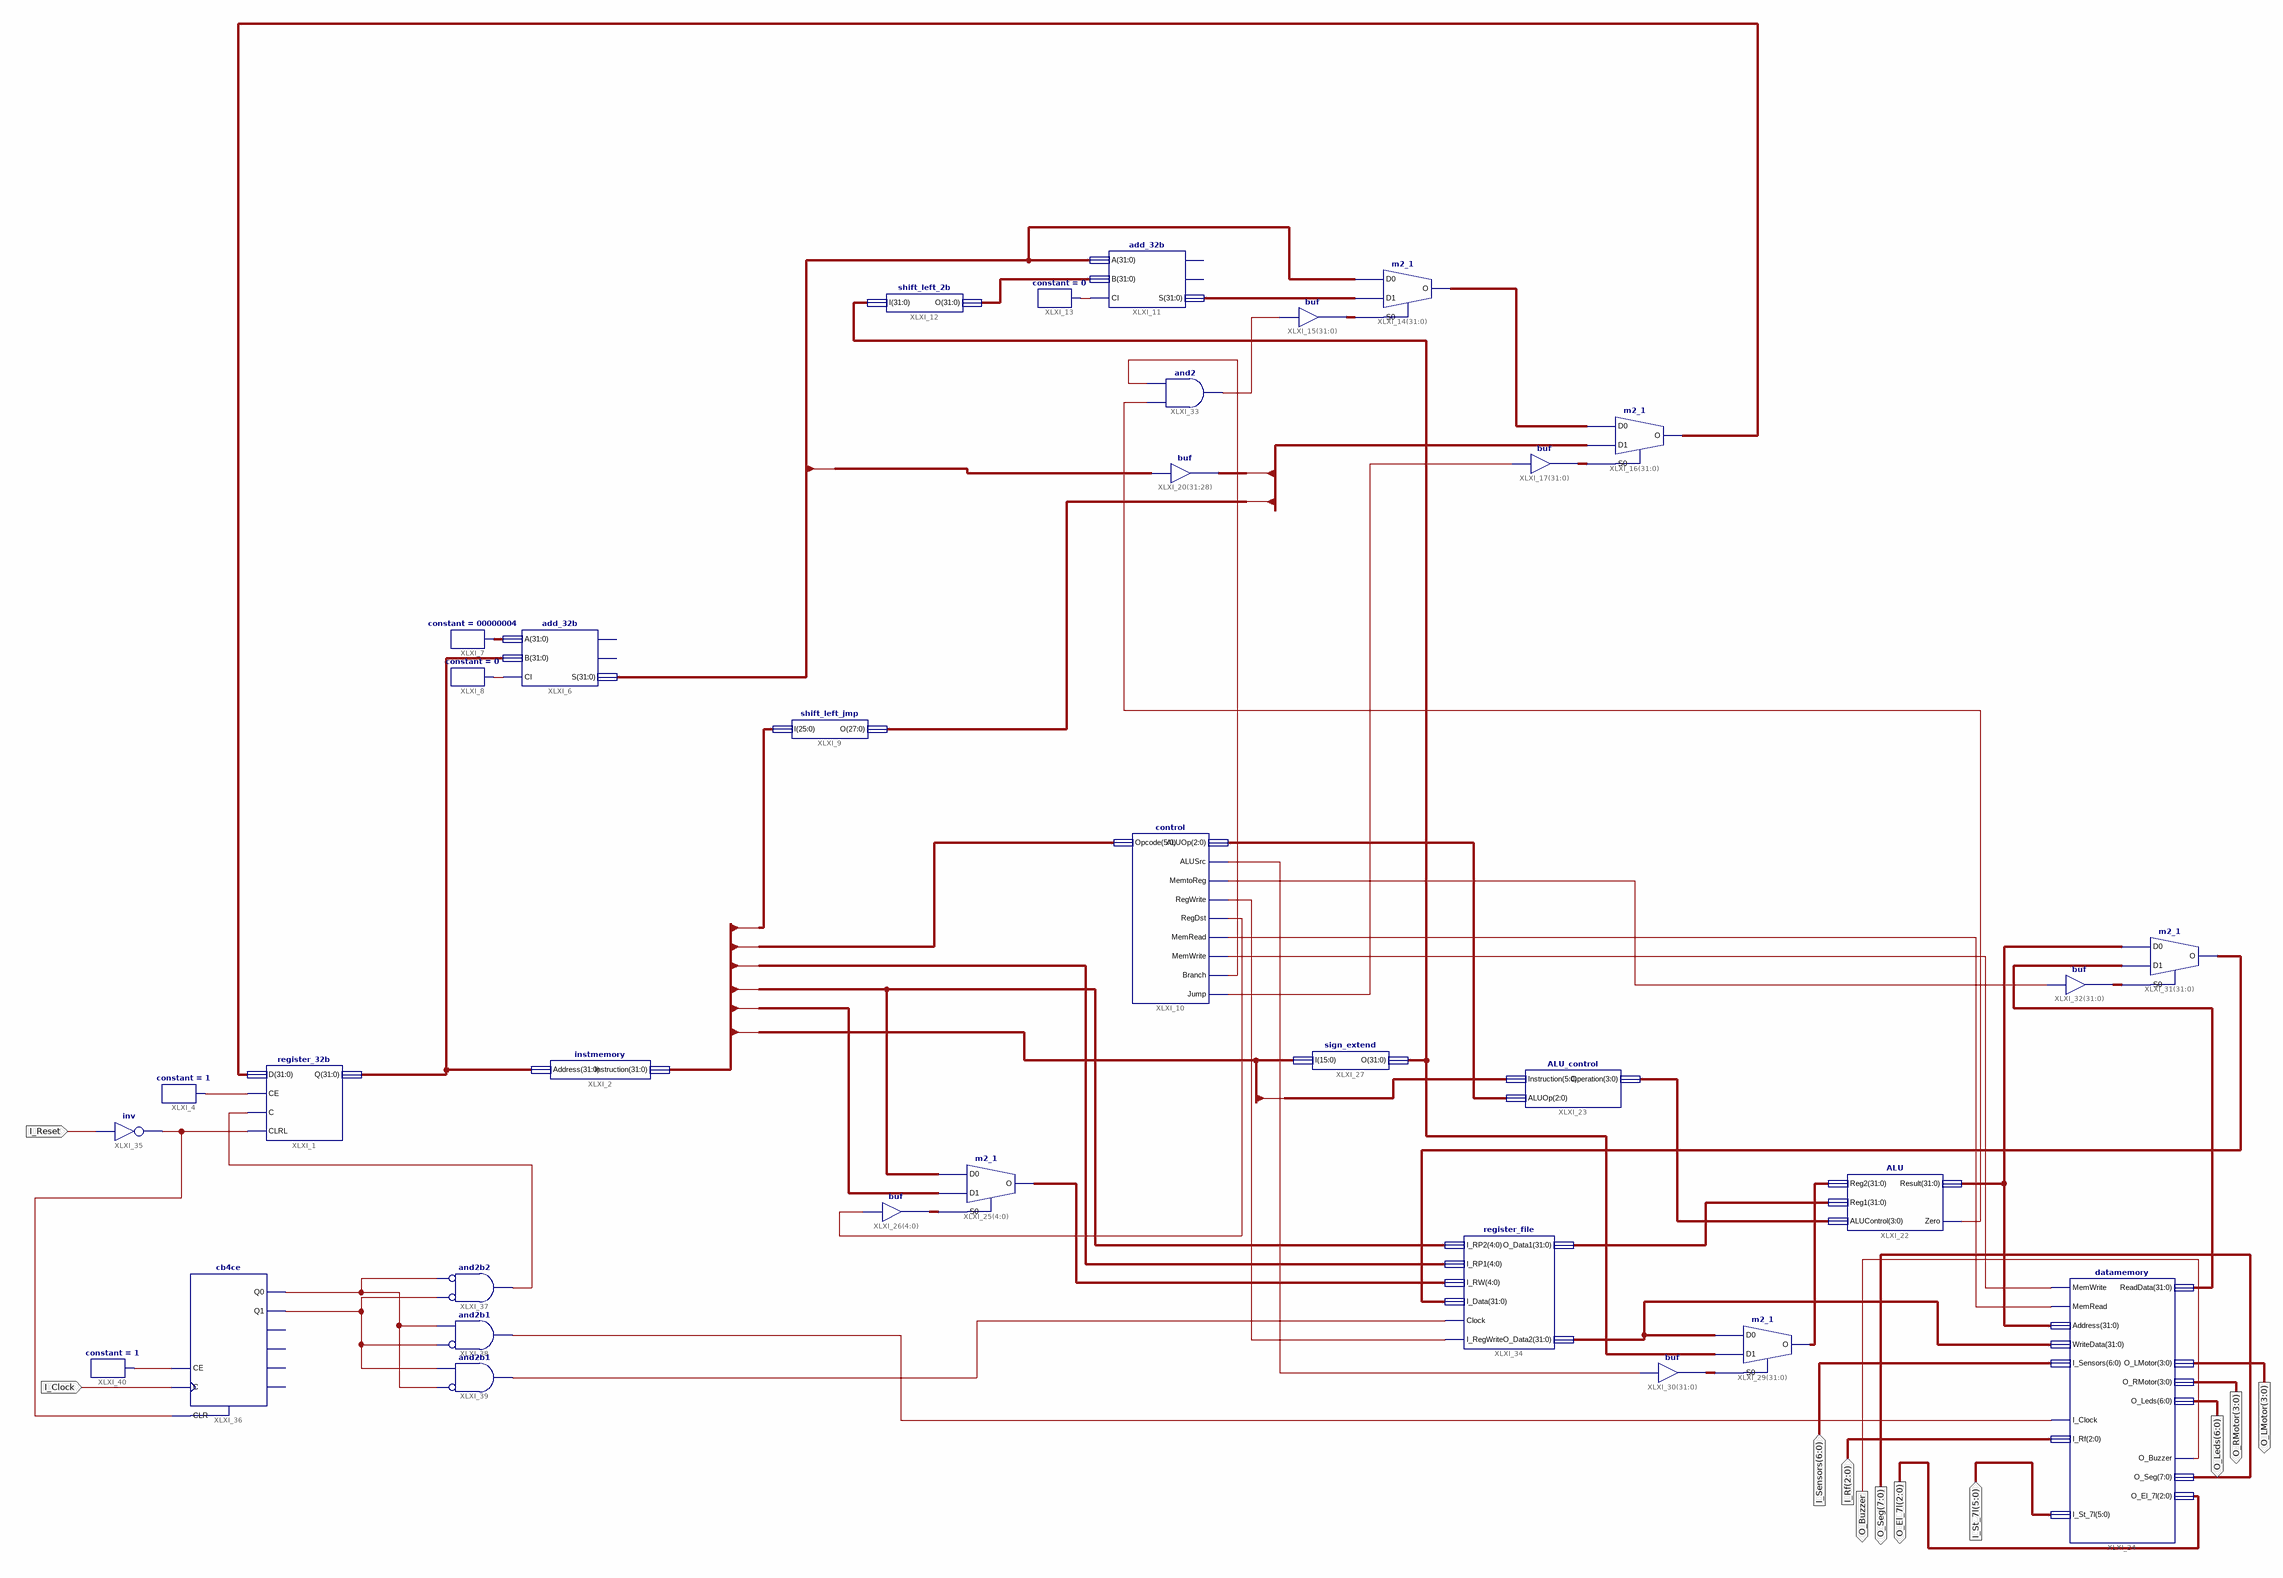
[diagram p0: schematic sheet 1]
// Xilinx ISE schematic top_cpu.sch (spartan3) as structural Verilog: 34 symbols, 11 ports
module top_cpu (
  input  I_Reset,
  input  [6:0] I_Sensors,
  input  I_Clock,
  input  [2:0] I_Rf,
  input  [5:0] I_St_7l,
  output [3:0] O_LMotor,
  output [3:0] O_RMotor,
  output [6:0] O_Leds,
  output [7:0] O_Seg,
  output [2:0] O_El_7l,
  output O_Buzzer
);

  wire XLXN_2, XLXN_7, XLXN_15, XLXN_36, XLXN_41, XLXN_48, XLXN_66, XLXN_68, XLXN_69, XLXN_70, XLXN_71,
       XLXN_72, XLXN_73, XLXN_78, XLXN_79, XLXN_80, XLXN_84, XLXN_85, XLXN_86, XLXN_88;
  wire [2:0] XLXN_39;
  wire [3:0] XLXN_50;
  wire [4:0] XLXN_35, XLXN_40;
  wire [31:0] jump_out, XLXN_4, XLXN_6, XLXN_8, XLXN_13, XLXN_14, XLXN_16, XLXN_18, XLXN_19, XLXN_20,
       XLXN_29, XLXN_45, XLXN_46, XLXN_47, XLXN_54, XLXN_55, XLXN_61, XLXN_63, XLXN_65, XLXN_67;

  register_32b XLXI_1 (.D(XLXN_29), .CE(XLXN_2), .C(XLXN_84), .CLRL(XLXN_78), .Q(XLXN_4));
  instmemory XLXI_2 (.Address(XLXN_4), .Instruction(XLXN_8));
  constant #(.CValue("1")) XLXI_4 (.O(XLXN_2));
  add_32b XLXI_6 (.A(XLXN_6), .B(XLXN_4), .CI(XLXN_7), .S(XLXN_13));  // open: OFL, CO
  constant #(.CValue("00000004")) XLXI_7 (.O(XLXN_6));
  constant #(.CValue("0")) XLXI_8 (.O(XLXN_7));
  shift_left_jmp XLXI_9 (.I(XLXN_8[25:0]), .O(jump_out[27:0]));
  control XLXI_10 (
    .Opcode(XLXN_8[31:26]), .ALUOp(XLXN_39), .ALUSrc(XLXN_48), .MemtoReg(XLXN_66), .RegWrite(XLXN_41),
    .RegDst(XLXN_36), .MemRead(XLXN_69), .MemWrite(XLXN_68), .Branch(XLXN_73), .Jump(XLXN_70));
  add_32b XLXI_11 (.A(XLXN_13), .B(XLXN_14), .CI(XLXN_15), .S(XLXN_16));  // open: OFL, CO
  shift_left_2b XLXI_12 (.I(XLXN_45), .O(XLXN_14));
  constant #(.CValue("0")) XLXI_13 (.O(XLXN_15));
  m2_1 XLXI_14[31:0] (.D0(XLXN_13), .D1(XLXN_16), .S0(XLXN_18), .O(XLXN_19));
  m2_1 XLXI_16[31:0] (.D0(XLXN_19), .D1(jump_out), .S0(XLXN_20), .O(XLXN_29));
  assign XLXN_20 = {32{XLXN_70}};  // buf XLXI_17[31..0], 32 bits wide
  assign jump_out[31:28] = XLXN_13[31:28];  // buf XLXI_20[31..28], 4 bits wide
  ALU XLXI_22 (.Reg2(XLXN_54), .Reg1(XLXN_63), .ALUControl(XLXN_50), .Result(XLXN_55), .Zero(XLXN_72));
  ALU_control XLXI_23 (.Instruction(XLXN_8[5:0]), .ALUOp(XLXN_39), .Operation(XLXN_50));
  datamemory XLXI_24 (
    .MemWrite(XLXN_68), .MemRead(XLXN_69), .I_Clock(XLXN_85), .Address(XLXN_55), .WriteData(XLXN_46),
    .I_Sensors(I_Sensors), .I_Rf(I_Rf), .O_Buzzer(O_Buzzer), .ReadData(XLXN_61), .O_LMotor(O_LMotor),
    .O_RMotor(O_RMotor), .O_Leds(O_Leds), .O_Seg(O_Seg), .O_El_7l(O_El_7l), .I_St_7l(I_St_7l));
  m2_1 XLXI_25[4:0] (.D0(XLXN_8[20:16]), .D1(XLXN_8[15:11]), .S0(XLXN_35), .O(XLXN_40));
  assign XLXN_18 = {32{XLXN_71}};  // buf XLXI_15[31..0], 32 bits wide
  assign XLXN_35 = {5{XLXN_36}};  // buf XLXI_26[4..0], 5 bits wide
  sign_extend XLXI_27 (.I(XLXN_8[15:0]), .O(XLXN_45));
  m2_1 XLXI_29[31:0] (.D0(XLXN_46), .D1(XLXN_45), .S0(XLXN_47), .O(XLXN_54));
  assign XLXN_47 = {32{XLXN_48}};  // buf XLXI_30[31..0], 32 bits wide
  m2_1 XLXI_31[31:0] (.D0(XLXN_55), .D1(XLXN_61), .S0(XLXN_65), .O(XLXN_67));
  assign XLXN_65 = {32{XLXN_66}};  // buf XLXI_32[31..0], 32 bits wide
  and XLXI_33 (XLXN_71, XLXN_72, XLXN_73);
  register_file XLXI_34 (
    .I_RP2(XLXN_8[20:16]), .I_RP1(XLXN_8[25:21]), .I_RW(XLXN_40), .I_Data(XLXN_67), .Clock(XLXN_86),
    .I_RegWrite(XLXN_41), .O_Data1(XLXN_63), .O_Data2(XLXN_46));
  not XLXI_35 (XLXN_78, I_Reset);
  cb4ce XLXI_36 (.C(I_Clock), .CE(XLXN_88), .CLR(XLXN_78), .Q0(XLXN_79), .Q1(XLXN_80));  // open: CEO, Q2, Q3, TC
  and XLXI_37 (XLXN_84, ~XLXN_80, ~XLXN_79);  // and2b2
  and XLXI_38 (XLXN_85, ~XLXN_80, XLXN_79);  // and2b1
  and XLXI_39 (XLXN_86, ~XLXN_79, XLXN_80);  // and2b1
  constant #(.CValue("1")) XLXI_40 (.O(XLXN_88));
endmodule
